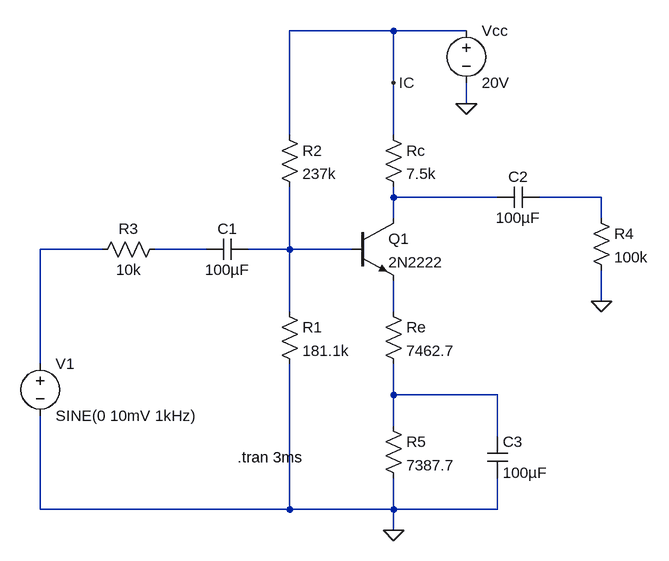
[diagram p0: schematic CE_Degeneration.asc]
CE_Degeneration.asc, the LTspice schematic file:
Version 4
SHEET 1 880 680
WIRE 320 -224 160 -224
WIRE 432 -224 320 -224
WIRE 320 -144 320 -224
WIRE 432 -112 432 -144
WIRE 160 -64 160 -224
WIRE 320 -64 320 -144
WIRE 320 32 320 16
WIRE 480 32 320 32
WIRE 640 32 544 32
WIRE 320 64 320 32
WIRE 640 64 640 32
WIRE -128 112 -224 112
WIRE 32 112 -48 112
WIRE 160 112 160 16
WIRE 160 112 96 112
WIRE 256 112 160 112
WIRE 640 192 640 144
WIRE 160 208 160 112
WIRE 320 208 320 160
WIRE -224 288 -224 112
WIRE 320 336 320 288
WIRE 480 336 320 336
WIRE 320 384 320 336
WIRE 480 400 480 336
WIRE -224 512 -224 368
WIRE 160 512 160 288
WIRE 160 512 -224 512
WIRE 320 512 320 464
WIRE 320 512 160 512
WIRE 480 512 480 464
WIRE 480 512 320 512
WIRE 320 544 320 512
FLAG 432 -112 0
FLAG 640 192 0
FLAG 320 -144 IC
FLAG 320 544 0
SYMBOL res 144 192 R0
SYMATTR InstName R1
SYMATTR Value 181.1k
SYMBOL res 144 -80 R0
SYMATTR InstName R2
SYMATTR Value 237k
SYMBOL res 304 192 R0
SYMATTR InstName Re
SYMATTR Value 7462.7
SYMBOL res 304 -80 R0
SYMATTR InstName Rc
SYMATTR Value 7.5k
SYMBOL npn 256 64 R0
SYMATTR InstName Q1
SYMATTR Value 2N2222
SYMBOL voltage 432 -240 R0
SYMATTR InstName Vcc
SYMATTR Value 20V
SYMBOL voltage -224 272 R0
WINDOW 123 0 0 Left 0
WINDOW 39 0 0 Left 0
SYMATTR InstName V1
SYMATTR Value SINE(0 10mV 1kHz)
SYMBOL cap 544 16 R90
WINDOW 0 0 32 VBottom 2
WINDOW 3 32 32 VTop 2
SYMATTR InstName C2
SYMATTR Value 100µF
SYMBOL res 624 48 R0
SYMATTR InstName R4
SYMATTR Value 100k
SYMBOL res -32 96 R90
WINDOW 0 0 56 VBottom 2
WINDOW 3 32 56 VTop 2
SYMATTR InstName R3
SYMATTR Value 10k
SYMBOL res 304 368 R0
SYMATTR InstName R5
SYMATTR Value 7387.7
SYMBOL cap 464 400 R0
SYMATTR InstName C3
SYMATTR Value 100µF
SYMBOL cap 96 96 R90
WINDOW 0 0 32 VBottom 2
WINDOW 3 32 32 VTop 2
SYMATTR InstName C1
SYMATTR Value 100µF
TEXT 80 432 Left 2 !.tran 3ms

The netlist it stands for:
* CE_Degeneration.asc
R1 N005 0 181.1k
R2 IC N005 237k
Re N006 N007 7462.7
Rc IC N001 7.5k
Q1 N001 N005 N006 0 2N2222
Vcc IC 0 20V
V1 N003 0 SINE(0 10mV 1kHz)
C2 N002 N001 100µF
R4 N002 0 100k
R3 N004 N003 10k
R5 N007 0 7387.7
C3 N007 0 100µF
C1 N005 N004 100µF
.model NPN NPN
.model PNP PNP
.lib standard.bjt
.tran 3ms
.backanno
.end